# Altium schematic sheet main_Rev1.SchDoc
size A4; SheetNumber: 1; SheetTotal: 1
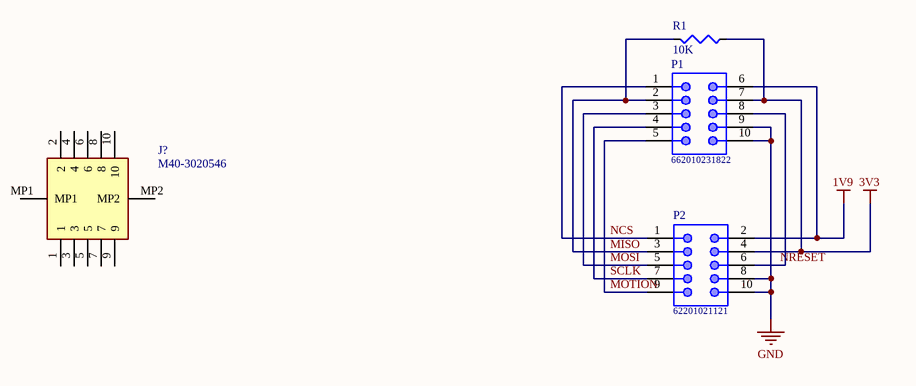
[diagram p0: main_Rev1.SchDoc]

## Parts
J?  M40-3020546  [M403020546]
P1  662010231822  [662010231822]
P2  62201021121  [62201021121]
R1  value 10K  [R0603]  (hidden comment: CPF-A-0603B100KE1)

## Nets
1V9: P1.6 P2.2
3V3: P1.7 P2.4 R1.1
GND: P1.9 P1.10 P2.8 P2.10
MISO: P1.2 P2.3 R1.2
MOSI: P1.3 P2.5
MOTION: P1.5 P2.9
NCS: P1.1 P2.1
NRESET: P1.8 P2.6
SCLK: P1.4 P2.7

Not connected (* = marked no-connect by the designer): J? 1 2 3 4 5 6 7 8 9 10 MP1 MP2

## Library data of the parts
J? = M40-3020546: Connector; Manufacturer_Name: Harwin; Datasheet Link: https://cdn.harwin.com/pdfs/M40-302.pdf; Height: 4.8mm; Manufacturer_Part_Number: M40-3020546
P1 = 662010231822: SMT Male Header WR-MPC3, with SMT Solder Tabs, Vertical, Dual Row, pitch 3 mm, 10 pins; Pitch: 3 mm; Working Voltage: 250 VAC; Contact Resistance: 10 mOhm; Pin Number: 10; ComponentLink1Description: Manufacturer; ComponentLink1URL: http://www.we-online.de; ComponentLink2Description: Datasheet; ComponentLink2URL: https://katalog.we-online.de/em/datasheet/6620xx231822.pdf; Part Number: 662010231822; Published Date: September 2018; Publisher: Wurth Elektronik; Operating Temperature: -40 to 105 degC; Packaging: Tray; Gender: Male; Mounting Technology: SMT; Orientation: Vertical
P2 = 62201021121: WR-PHD Pin Header, THT, pitch 1.27mm, Dual Row, Vertical, 10p; Manufacturer: Wurth Elektronik; Pin Number: 10; Rated Current: 1A; Working Voltage: 100VAC; Withstanding Voltage: 500VAC; Contact Resistance: 20mOhm; ComponentLink1Description: Manufacturer; ComponentLink1URL: http://www.we-online.de; ComponentLink2Description: Datasheet; ComponentLink2URL: https://www.we-online.com/catalog/datasheet/62201021121.pdf; Manufacturer Part Number: 62201021121; Published Date: May 2020; Pitch: 1.27mm; Operating Temperature: -40 to +105degC; Mounting Technology: THT; Packaging: Box; Gender: Pin Header; Row Number: Dual; Orientation: Vertical
R1 = CPF-A-0603B100KE1: Pullup MISO.; Parameter 1: R 0603 10K 0.1W 1%